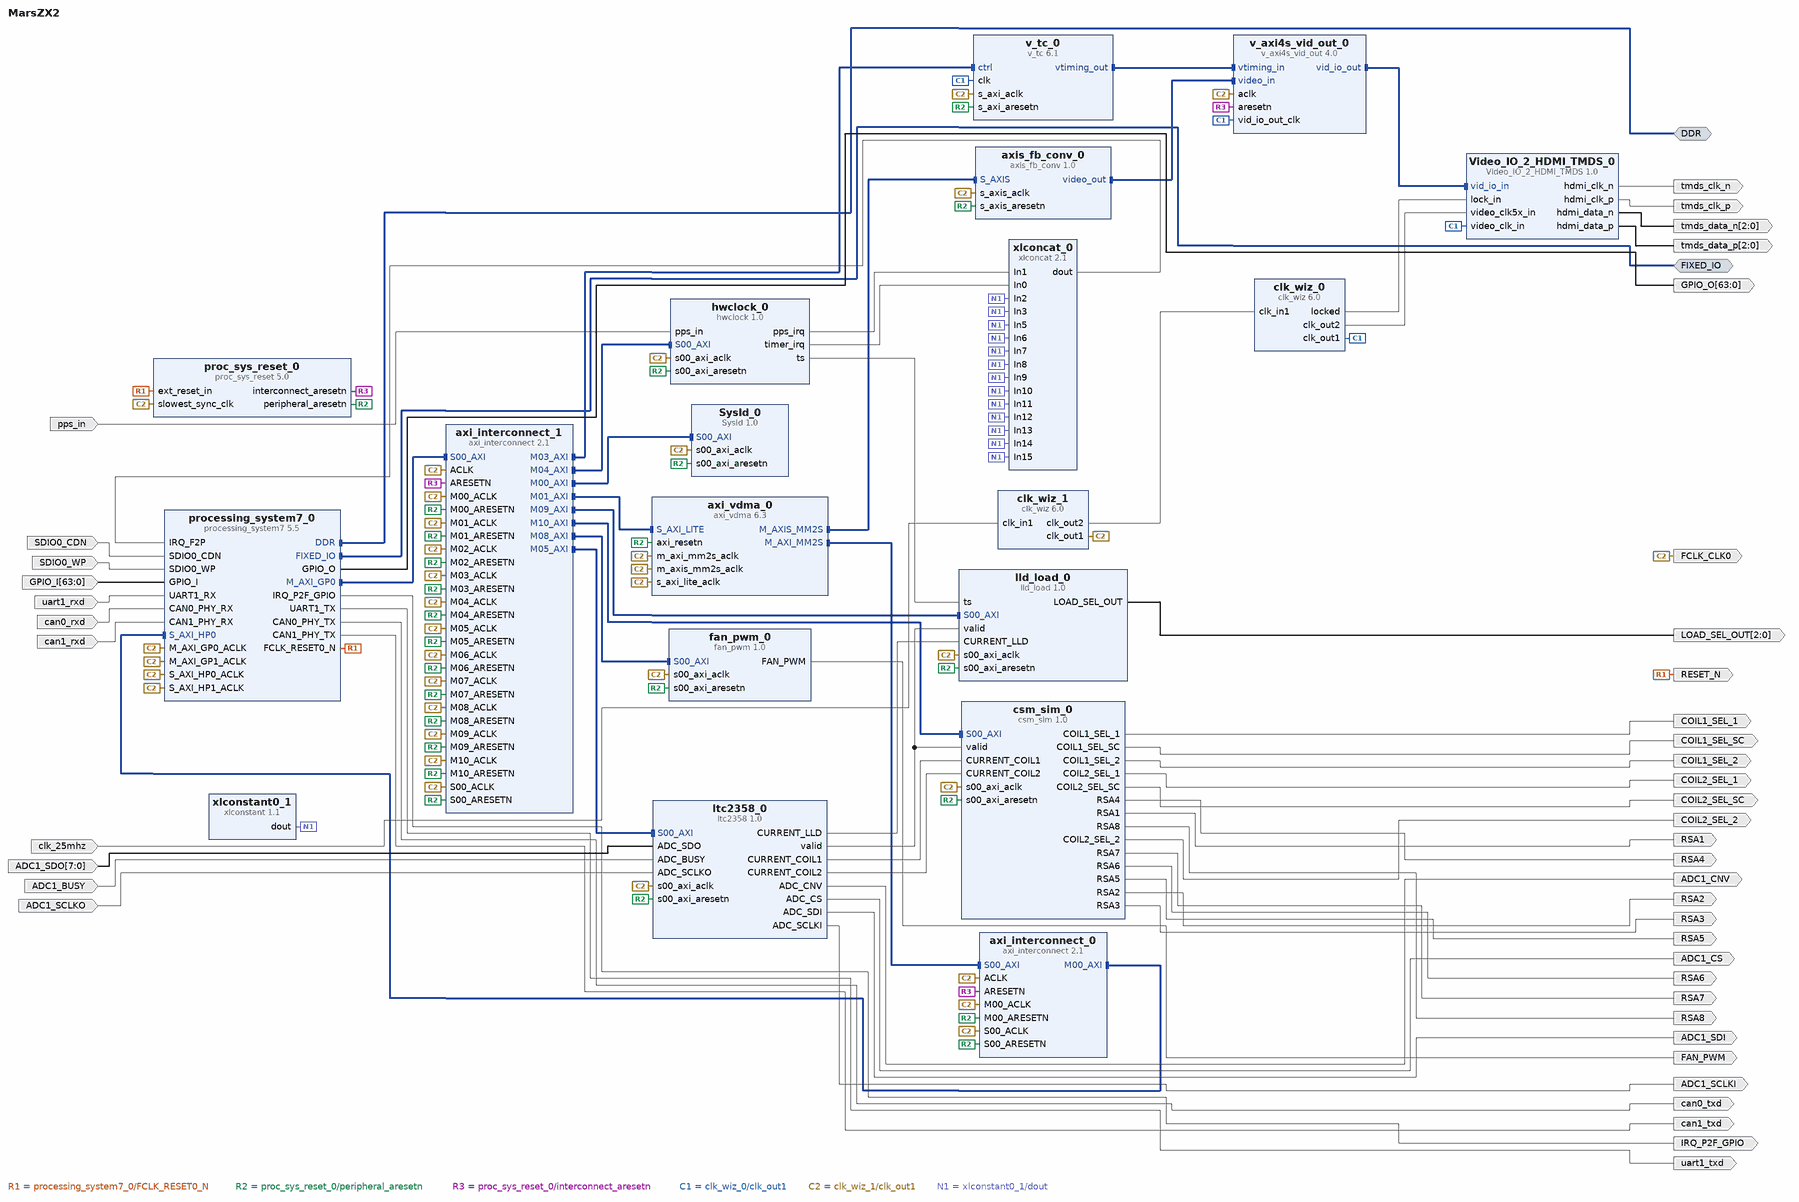
[diagram p0: block diagram of the top level]
# Vivado block design MarsZX2, xc7z010clg400-2, Vivado 2019.1
create_bd_design MarsZX2

create_bd_intf_port -mode Master -vlnv xilinx.com:interface:ddrx_rtl:1.0 DDR
create_bd_intf_port -mode Master -vlnv xilinx.com:display_processing_system7:fixedio_rtl:1.0 FIXED_IO
create_bd_port -dir I SDIO0_CDN
create_bd_port -dir I SDIO0_WP
create_bd_port -dir O -type clk FCLK_CLK0
create_bd_port -dir O -type rst RESET_N
create_bd_port -dir I -from 63 -to 0 GPIO_I
create_bd_port -dir O -from 63 -to 0 GPIO_O
create_bd_port -dir O IRQ_P2F_GPIO
create_bd_port -dir O -from 2 -to 0 tmds_data_p
create_bd_port -dir O -from 2 -to 0 tmds_data_n
create_bd_port -dir O -type clk tmds_clk_p
create_bd_port -dir O -type clk tmds_clk_n
create_bd_port -dir I -type clk clk_25mhz
set_property -dict {CONFIG.FREQ_HZ 25000000} [get_bd_ports clk_25mhz]
create_bd_port -dir I pps_in
create_bd_port -dir I uart1_rxd
create_bd_port -dir O uart1_txd
create_bd_port -dir I can0_rxd
create_bd_port -dir I can1_rxd
create_bd_port -dir O can0_txd
create_bd_port -dir O can1_txd
create_bd_port -dir O ADC1_SDI
create_bd_port -dir O ADC1_CNV
create_bd_port -dir O ADC1_CS
create_bd_port -dir O ADC1_SCLKI
create_bd_port -dir I ADC1_SCLKO
create_bd_port -dir I ADC1_BUSY
create_bd_port -dir I -from 7 -to 0 ADC1_SDO
create_bd_port -dir O RSA1
create_bd_port -dir O RSA2
create_bd_port -dir O RSA3
create_bd_port -dir O RSA4
create_bd_port -dir O RSA5
create_bd_port -dir O RSA6
create_bd_port -dir O RSA7
create_bd_port -dir O RSA8
create_bd_port -dir O -from 2 -to 0 LOAD_SEL_OUT
create_bd_port -dir O COIL1_SEL_SC
create_bd_port -dir O COIL1_SEL_1
create_bd_port -dir O COIL1_SEL_2
create_bd_port -dir O COIL2_SEL_SC
create_bd_port -dir O COIL2_SEL_1
create_bd_port -dir O COIL2_SEL_2
create_bd_port -dir O FAN_PWM

create_bd_cell -type ip -vlnv xilinx.com:user:SysId:1.0 SysId_0
set_property -dict {CONFIG.C_FPGA_ID 0x32320101} [get_bd_cells SysId_0]
create_bd_cell -type ip -vlnv trenz.biz:user:Video_IO_2_HDMI_TMDS:1.0 Video_IO_2_HDMI_TMDS_0
set_property -dict {CONFIG.C_INT_CLOCKING false} [get_bd_cells Video_IO_2_HDMI_TMDS_0]
create_bd_cell -type ip -vlnv xilinx.com:ip:axi_interconnect:2.1 axi_interconnect_0
set_property -dict {CONFIG.NUM_MI 1} [get_bd_cells axi_interconnect_0]
create_bd_cell -type ip -vlnv xilinx.com:ip:axi_interconnect:2.1 axi_interconnect_1
set_property -dict {CONFIG.NUM_MI 11 CONFIG.NUM_SI 1} [get_bd_cells axi_interconnect_1]
create_bd_cell -type ip -vlnv xilinx.com:ip:axi_vdma:6.3 axi_vdma_0
set_property -dict [list \
  CONFIG.c_include_s2mm 0 \
  CONFIG.c_mm2s_genlock_mode 0 \
  CONFIG.c_mm2s_max_burst_length 64 \
  CONFIG.c_num_fstores 1 \
] [get_bd_cells axi_vdma_0]
create_bd_cell -type ip -vlnv trenz.biz:user:axis_fb_conv:1.0 axis_fb_conv_0
create_bd_cell -type ip -vlnv xilinx.com:ip:clk_wiz:6.0 clk_wiz_0
set_property -dict [list \
  CONFIG.AXI_DRP false \
  CONFIG.CLKIN1_JITTER_PS 50.0 \
  CONFIG.CLKOUT1_JITTER 508.816 \
  CONFIG.CLKOUT1_PHASE_ERROR 431.542 \
  CONFIG.CLKOUT1_REQUESTED_OUT_FREQ 26.615 \
  CONFIG.CLKOUT2_JITTER 392.572 \
  CONFIG.CLKOUT2_PHASE_ERROR 431.542 \
  CONFIG.CLKOUT2_REQUESTED_OUT_FREQ 133.075 \
  CONFIG.CLKOUT2_USED true \
  CONFIG.CLKOUT3_JITTER 322.303 \
  CONFIG.CLKOUT3_PHASE_ERROR 494.032 \
  CONFIG.CLKOUT3_REQUESTED_OUT_FREQ 100.000 \
  CONFIG.CLKOUT3_USED false \
  CONFIG.MMCM_CLKFBOUT_MULT_F 43.250 \
  CONFIG.MMCM_CLKIN1_PERIOD 5.000 \
  CONFIG.MMCM_CLKIN2_PERIOD 10.0 \
  CONFIG.MMCM_CLKOUT0_DIVIDE_F 25.000 \
  CONFIG.MMCM_CLKOUT1_DIVIDE 5 \
  CONFIG.MMCM_CLKOUT2_DIVIDE 1 \
  CONFIG.MMCM_DIVCLK_DIVIDE 13 \
  CONFIG.NUM_OUT_CLKS 2 \
  CONFIG.PHASE_DUTY_CONFIG false \
  CONFIG.PRIM_IN_FREQ 200 \
  CONFIG.USE_DYN_RECONFIG false \
  CONFIG.USE_LOCKED true \
  CONFIG.USE_RESET false \
] [get_bd_cells clk_wiz_0]
create_bd_cell -type ip -vlnv xilinx.com:ip:clk_wiz:6.0 clk_wiz_1
set_property -dict [list \
  CONFIG.CLKIN1_JITTER_PS 400.0 \
  CONFIG.CLKOUT1_JITTER 226.965 \
  CONFIG.CLKOUT1_PHASE_ERROR 237.727 \
  CONFIG.CLKOUT2_JITTER 206.578 \
  CONFIG.CLKOUT2_PHASE_ERROR 237.727 \
  CONFIG.CLKOUT2_REQUESTED_OUT_FREQ 200 \
  CONFIG.CLKOUT2_USED true \
  CONFIG.MMCM_CLKFBOUT_MULT_F 40.000 \
  CONFIG.MMCM_CLKIN1_PERIOD 40.000 \
  CONFIG.MMCM_CLKIN2_PERIOD 10.0 \
  CONFIG.MMCM_CLKOUT1_DIVIDE 5 \
  CONFIG.NUM_OUT_CLKS 2 \
  CONFIG.PRIM_IN_FREQ 25 \
  CONFIG.USE_LOCKED false \
  CONFIG.USE_RESET false \
] [get_bd_cells clk_wiz_1]
create_bd_cell -type ip -vlnv xilinx.com:ip:proc_sys_reset:5.0 proc_sys_reset_0
create_bd_cell -type ip -vlnv xilinx.com:ip:processing_system7:5.5 processing_system7_0
set_property -dict [list \
  CONFIG.PCW_APU_PERIPHERAL_FREQMHZ 750 \
  CONFIG.PCW_CAN0_CAN0_IO EMIO \
  CONFIG.PCW_CAN0_PERIPHERAL_ENABLE 1 \
  CONFIG.PCW_CAN1_CAN1_IO EMIO \
  CONFIG.PCW_CAN1_PERIPHERAL_ENABLE 1 \
  CONFIG.PCW_CPU_CPU_6X4X_MAX_RANGE 767 \
  CONFIG.PCW_CRYSTAL_PERIPHERAL_FREQMHZ 33.333333333333 \
  CONFIG.PCW_ENET0_ENET0_IO {MIO 16 .. 27} \
  CONFIG.PCW_ENET0_GRP_MDIO_ENABLE 1 \
  CONFIG.PCW_ENET0_GRP_MDIO_IO {MIO 52 .. 53} \
  CONFIG.PCW_ENET0_PERIPHERAL_ENABLE 1 \
  CONFIG.PCW_ENET_RESET_ENABLE 0 \
  CONFIG.PCW_FCLK0_PERIPHERAL_CLKSRC {ARM PLL} \
  CONFIG.PCW_FCLK_CLK0_BUF FALSE \
  CONFIG.PCW_FPGA0_PERIPHERAL_FREQMHZ 100 \
  CONFIG.PCW_FPGA1_PERIPHERAL_FREQMHZ 50 \
  CONFIG.PCW_GP0_EN_MODIFIABLE_TXN 0 \
  CONFIG.PCW_GP1_EN_MODIFIABLE_TXN 0 \
  CONFIG.PCW_GPIO_EMIO_GPIO_ENABLE 1 \
  CONFIG.PCW_GPIO_EMIO_GPIO_IO 64 \
  CONFIG.PCW_GPIO_MIO_GPIO_ENABLE 1 \
  CONFIG.PCW_GPIO_MIO_GPIO_IO MIO \
  CONFIG.PCW_I2C0_GRP_INT_ENABLE 1 \
  CONFIG.PCW_I2C0_GRP_INT_IO EMIO \
  CONFIG.PCW_I2C0_I2C0_IO {MIO 14 .. 15} \
  CONFIG.PCW_I2C0_PERIPHERAL_ENABLE 1 \
  CONFIG.PCW_I2C_PERIPHERAL_FREQMHZ 125.000000 \
  CONFIG.PCW_I2C_RESET_ENABLE 0 \
  CONFIG.PCW_IRQ_F2P_INTR 1 \
  CONFIG.PCW_OVERRIDE_BASIC_CLOCK 1 \
  CONFIG.PCW_P2F_GPIO_INTR 1 \
  CONFIG.PCW_PERIPHERAL_BOARD_PRESET None \
  CONFIG.PCW_PRESET_BANK1_VOLTAGE {LVCMOS 3.3V} \
  CONFIG.PCW_QSPI_GRP_FBCLK_ENABLE 1 \
  CONFIG.PCW_QSPI_GRP_FBCLK_IO {MIO 8} \
  CONFIG.PCW_QSPI_GRP_SINGLE_SS_ENABLE 1 \
  CONFIG.PCW_QSPI_GRP_SINGLE_SS_IO {MIO 1 .. 6} \
  CONFIG.PCW_QSPI_PERIPHERAL_ENABLE 1 \
  CONFIG.PCW_QSPI_QSPI_IO {MIO 1 .. 6} \
  CONFIG.PCW_SD0_GRP_CD_ENABLE 1 \
  CONFIG.PCW_SD0_GRP_CD_IO EMIO \
  CONFIG.PCW_SD0_GRP_WP_ENABLE 1 \
  CONFIG.PCW_SD0_GRP_WP_IO EMIO \
  CONFIG.PCW_SD0_PERIPHERAL_ENABLE 1 \
  CONFIG.PCW_SD0_SD0_IO {MIO 40 .. 45} \
  CONFIG.PCW_SDIO_PERIPHERAL_FREQMHZ 100 \
  CONFIG.PCW_SINGLE_QSPI_DATA_MODE x4 \
  CONFIG.PCW_S_AXI_HP1_DATA_WIDTH 32 \
  CONFIG.PCW_TTC1_PERIPHERAL_ENABLE 1 \
  CONFIG.PCW_TTC1_TTC1_IO EMIO \
  CONFIG.PCW_UART0_PERIPHERAL_ENABLE 1 \
  CONFIG.PCW_UART0_UART0_IO {MIO 46 .. 47} \
  CONFIG.PCW_UART1_PERIPHERAL_ENABLE 1 \
  CONFIG.PCW_UART1_UART1_IO EMIO \
  CONFIG.PCW_UART_PERIPHERAL_FREQMHZ 100 \
  CONFIG.PCW_UIPARAM_DDR_BUS_WIDTH {16 Bit} \
  CONFIG.PCW_UIPARAM_DDR_FREQ_MHZ 533.3333 \
  CONFIG.PCW_UIPARAM_DDR_MEMORY_TYPE {DDR 3 (Low Voltage)} \
  CONFIG.PCW_UIPARAM_DDR_PARTNO {MT41K256M16 RE-125} \
  CONFIG.PCW_USB0_PERIPHERAL_ENABLE 1 \
  CONFIG.PCW_USB0_USB0_IO {MIO 28 .. 39} \
  CONFIG.PCW_USB_RESET_ENABLE 0 \
  CONFIG.PCW_USE_FABRIC_INTERRUPT 1 \
  CONFIG.PCW_USE_M_AXI_GP1 1 \
  CONFIG.PCW_USE_S_AXI_HP0 1 \
  CONFIG.PCW_USE_S_AXI_HP1 1 \
  CONFIG.PCW_WDT_PERIPHERAL_ENABLE 1 \
  CONFIG.PCW_WDT_WDT_IO EMIO \
] [get_bd_cells processing_system7_0]
# 546 more settings of processing_system7_0 are not shown: defaults, MIO pin electricals, DDR timing, and values the tool derives
create_bd_cell -type ip -vlnv xilinx.com:ip:v_axi4s_vid_out:4.0 v_axi4s_vid_out_0
set_property -dict {CONFIG.C_HAS_ASYNC_CLK 1 CONFIG.C_VTG_MASTER_SLAVE 1} [get_bd_cells v_axi4s_vid_out_0]
create_bd_cell -type ip -vlnv xilinx.com:ip:v_tc:6.1 v_tc_0
set_property -dict [list \
  CONFIG.GEN_F0_VBLANK_HEND 800 \
  CONFIG.GEN_F0_VBLANK_HSTART 800 \
  CONFIG.GEN_F0_VFRAME_SIZE 504 \
  CONFIG.GEN_F0_VSYNC_HEND 800 \
  CONFIG.GEN_F0_VSYNC_HSTART 800 \
  CONFIG.GEN_F0_VSYNC_VEND 484 \
  CONFIG.GEN_F0_VSYNC_VSTART 480 \
  CONFIG.GEN_HACTIVE_SIZE 800 \
  CONFIG.GEN_HFRAME_SIZE 1056 \
  CONFIG.GEN_HSYNC_END 968 \
  CONFIG.GEN_HSYNC_START 840 \
  CONFIG.GEN_VACTIVE_SIZE 480 \
  CONFIG.VIDEO_MODE Custom \
  CONFIG.enable_detection false \
] [get_bd_cells v_tc_0]
create_bd_cell -type ip -vlnv xilinx.com:ip:xlconcat:2.1 xlconcat_0
set_property -dict {CONFIG.NUM_PORTS 16 CONFIG.dout_width 16} [get_bd_cells xlconcat_0]
create_bd_cell -type ip -vlnv xilinx.com:ip:xlconstant:1.1 xlconstant0_1
set_property -dict {CONFIG.CONST_VAL 0} [get_bd_cells xlconstant0_1]
create_bd_cell -type ip -vlnv user.org:user:hwclock:1.0 hwclock_0
create_bd_cell -type ip -vlnv user.org:user:ltc2358:1.0 ltc2358_0
create_bd_cell -type ip -vlnv user.org:user:lld_load:1.0 lld_load_0
create_bd_cell -type ip -vlnv user.org:user:csm_sim:1.0 csm_sim_0
create_bd_cell -type ip -vlnv user.org:user:fan_pwm:1.0 fan_pwm_0

# ---- connections ----

connect_bd_intf_net [get_bd_intf_pins processing_system7_0/S_AXI_HP0] [get_bd_intf_pins axi_interconnect_0/M00_AXI]
connect_bd_intf_net [get_bd_intf_pins axi_interconnect_1/M05_AXI] [get_bd_intf_pins ltc2358_0/S00_AXI]
connect_bd_intf_net [get_bd_intf_pins axi_vdma_0/S_AXI_LITE] [get_bd_intf_pins axi_interconnect_1/M01_AXI]
connect_bd_intf_net [get_bd_intf_pins v_axi4s_vid_out_0/video_in] [get_bd_intf_pins axis_fb_conv_0/video_out]
connect_bd_intf_net [get_bd_intf_pins Video_IO_2_HDMI_TMDS_0/vid_io_in] [get_bd_intf_pins v_axi4s_vid_out_0/vid_io_out]
connect_bd_intf_net [get_bd_intf_ports DDR] [get_bd_intf_pins processing_system7_0/DDR]
connect_bd_intf_net [get_bd_intf_pins SysId_0/S00_AXI] [get_bd_intf_pins axi_interconnect_1/M00_AXI]
connect_bd_intf_net [get_bd_intf_pins v_tc_0/ctrl] [get_bd_intf_pins axi_interconnect_1/M03_AXI]
connect_bd_intf_net [get_bd_intf_pins v_axi4s_vid_out_0/vtiming_in] [get_bd_intf_pins v_tc_0/vtiming_out]
connect_bd_intf_net [get_bd_intf_pins axi_interconnect_1/M04_AXI] [get_bd_intf_pins hwclock_0/S00_AXI]
connect_bd_intf_net [get_bd_intf_pins processing_system7_0/M_AXI_GP0] [get_bd_intf_pins axi_interconnect_1/S00_AXI]
connect_bd_intf_net [get_bd_intf_ports FIXED_IO] [get_bd_intf_pins processing_system7_0/FIXED_IO]
connect_bd_intf_net [get_bd_intf_pins axi_interconnect_0/S00_AXI] [get_bd_intf_pins axi_vdma_0/M_AXI_MM2S]
connect_bd_intf_net [get_bd_intf_pins csm_sim_0/S00_AXI] [get_bd_intf_pins axi_interconnect_1/M10_AXI]
connect_bd_intf_net [get_bd_intf_pins axis_fb_conv_0/S_AXIS] [get_bd_intf_pins axi_vdma_0/M_AXIS_MM2S]
connect_bd_intf_net [get_bd_intf_pins lld_load_0/S00_AXI] [get_bd_intf_pins axi_interconnect_1/M09_AXI]
connect_bd_intf_net [get_bd_intf_pins fan_pwm_0/S00_AXI] [get_bd_intf_pins axi_interconnect_1/M08_AXI]
connect_bd_net [get_bd_pins processing_system7_0/FCLK_RESET0_N] [get_bd_ports RESET_N] [get_bd_pins proc_sys_reset_0/ext_reset_in]
connect_bd_net [get_bd_pins proc_sys_reset_0/peripheral_aresetn] \
  [get_bd_pins SysId_0/s00_axi_aresetn] [get_bd_pins axi_interconnect_0/S00_ARESETN] \
  [get_bd_pins axi_interconnect_0/M00_ARESETN] [get_bd_pins axi_interconnect_1/S00_ARESETN] \
  [get_bd_pins axi_interconnect_1/M00_ARESETN] [get_bd_pins axi_interconnect_1/M01_ARESETN] \
  [get_bd_pins axi_interconnect_1/M02_ARESETN] [get_bd_pins axi_interconnect_1/M03_ARESETN] \
  [get_bd_pins axi_interconnect_1/M04_ARESETN] [get_bd_pins axi_interconnect_1/M05_ARESETN] \
  [get_bd_pins axi_interconnect_1/M06_ARESETN] [get_bd_pins axi_interconnect_1/M07_ARESETN] \
  [get_bd_pins axi_interconnect_1/M08_ARESETN] [get_bd_pins axi_interconnect_1/M09_ARESETN] \
  [get_bd_pins axi_interconnect_1/M10_ARESETN] [get_bd_pins axi_vdma_0/axi_resetn] \
  [get_bd_pins axis_fb_conv_0/s_axis_aresetn] [get_bd_pins v_tc_0/s_axi_aresetn] [get_bd_pins hwclock_0/s00_axi_aresetn] \
  [get_bd_pins ltc2358_0/s00_axi_aresetn] [get_bd_pins lld_load_0/s00_axi_aresetn] [get_bd_pins csm_sim_0/s00_axi_aresetn] \
  [get_bd_pins fan_pwm_0/s00_axi_aresetn]
connect_bd_net [get_bd_pins proc_sys_reset_0/interconnect_aresetn] \
  [get_bd_pins axi_interconnect_0/ARESETN] [get_bd_pins axi_interconnect_1/ARESETN] [get_bd_pins v_axi4s_vid_out_0/aresetn]
connect_bd_net [get_bd_ports SDIO0_CDN] [get_bd_pins processing_system7_0/SDIO0_CDN]
connect_bd_net [get_bd_pins processing_system7_0/GPIO_O] [get_bd_ports GPIO_O]
connect_bd_net [get_bd_pins xlconcat_0/dout] [get_bd_pins processing_system7_0/IRQ_F2P]
connect_bd_net [get_bd_pins processing_system7_0/IRQ_P2F_GPIO] [get_bd_ports IRQ_P2F_GPIO]
connect_bd_net [get_bd_ports SDIO0_WP] [get_bd_pins processing_system7_0/SDIO0_WP]
connect_bd_net [get_bd_ports GPIO_I] [get_bd_pins processing_system7_0/GPIO_I]
connect_bd_net [get_bd_pins clk_wiz_0/clk_out1] \
  [get_bd_pins Video_IO_2_HDMI_TMDS_0/video_clk_in] [get_bd_pins v_axi4s_vid_out_0/vid_io_out_clk] [get_bd_pins v_tc_0/clk]
connect_bd_net [get_bd_pins Video_IO_2_HDMI_TMDS_0/hdmi_data_p] [get_bd_ports tmds_data_p]
connect_bd_net [get_bd_pins Video_IO_2_HDMI_TMDS_0/hdmi_data_n] [get_bd_ports tmds_data_n]
connect_bd_net [get_bd_pins Video_IO_2_HDMI_TMDS_0/hdmi_clk_p] [get_bd_ports tmds_clk_p]
connect_bd_net [get_bd_pins Video_IO_2_HDMI_TMDS_0/hdmi_clk_n] [get_bd_ports tmds_clk_n]
connect_bd_net [get_bd_pins clk_wiz_0/locked] [get_bd_pins Video_IO_2_HDMI_TMDS_0/lock_in]
connect_bd_net [get_bd_ports clk_25mhz] [get_bd_pins clk_wiz_1/clk_in1]
connect_bd_net [get_bd_pins hwclock_0/pps_irq] [get_bd_pins xlconcat_0/In1]
connect_bd_net [get_bd_ports pps_in] [get_bd_pins hwclock_0/pps_in]
connect_bd_net [get_bd_pins hwclock_0/timer_irq] [get_bd_pins xlconcat_0/In0]
connect_bd_net -net processing_system7_0_FCLK_CLK0 [get_bd_pins clk_wiz_1/clk_out1] \
  [get_bd_ports FCLK_CLK0] [get_bd_pins SysId_0/s00_axi_aclk] [get_bd_pins axi_interconnect_0/ACLK] \
  [get_bd_pins axi_interconnect_0/S00_ACLK] [get_bd_pins axi_interconnect_0/M00_ACLK] [get_bd_pins axi_interconnect_1/ACLK] \
  [get_bd_pins axi_interconnect_1/S00_ACLK] [get_bd_pins axi_interconnect_1/M00_ACLK] \
  [get_bd_pins axi_interconnect_1/M01_ACLK] [get_bd_pins axi_interconnect_1/M02_ACLK] \
  [get_bd_pins axi_interconnect_1/M03_ACLK] [get_bd_pins axi_interconnect_1/M04_ACLK] \
  [get_bd_pins axi_interconnect_1/M05_ACLK] [get_bd_pins axi_interconnect_1/M06_ACLK] \
  [get_bd_pins axi_interconnect_1/M07_ACLK] [get_bd_pins axi_interconnect_1/M08_ACLK] \
  [get_bd_pins axi_interconnect_1/M09_ACLK] [get_bd_pins axi_interconnect_1/M10_ACLK] \
  [get_bd_pins axi_vdma_0/s_axi_lite_aclk] [get_bd_pins axi_vdma_0/m_axi_mm2s_aclk] [get_bd_pins axi_vdma_0/m_axis_mm2s_aclk] \
  [get_bd_pins axis_fb_conv_0/s_axis_aclk] [get_bd_pins proc_sys_reset_0/slowest_sync_clk] \
  [get_bd_pins processing_system7_0/M_AXI_GP0_ACLK] [get_bd_pins processing_system7_0/M_AXI_GP1_ACLK] \
  [get_bd_pins processing_system7_0/S_AXI_HP0_ACLK] [get_bd_pins processing_system7_0/S_AXI_HP1_ACLK] \
  [get_bd_pins v_axi4s_vid_out_0/aclk] [get_bd_pins v_tc_0/s_axi_aclk] [get_bd_pins hwclock_0/s00_axi_aclk] \
  [get_bd_pins ltc2358_0/s00_axi_aclk] [get_bd_pins lld_load_0/s00_axi_aclk] [get_bd_pins csm_sim_0/s00_axi_aclk] \
  [get_bd_pins fan_pwm_0/s00_axi_aclk]
connect_bd_net [get_bd_pins clk_wiz_0/clk_out2] [get_bd_pins Video_IO_2_HDMI_TMDS_0/video_clk5x_in]
connect_bd_net [get_bd_ports uart1_rxd] [get_bd_pins processing_system7_0/UART1_RX]
connect_bd_net [get_bd_pins processing_system7_0/UART1_TX] [get_bd_ports uart1_txd]
connect_bd_net [get_bd_pins hwclock_0/ts] [get_bd_pins lld_load_0/ts]
connect_bd_net [get_bd_pins processing_system7_0/CAN0_PHY_TX] [get_bd_ports can0_txd]
connect_bd_net [get_bd_pins processing_system7_0/CAN1_PHY_TX] [get_bd_ports can1_txd]
connect_bd_net [get_bd_ports can0_rxd] [get_bd_pins processing_system7_0/CAN0_PHY_RX]
connect_bd_net [get_bd_ports can1_rxd] [get_bd_pins processing_system7_0/CAN1_PHY_RX]
connect_bd_net -net xlconstant_1_dout [get_bd_pins xlconstant0_1/dout] \
  [get_bd_pins xlconcat_0/In2] [get_bd_pins xlconcat_0/In3] [get_bd_pins xlconcat_0/In5] [get_bd_pins xlconcat_0/In6] \
  [get_bd_pins xlconcat_0/In7] [get_bd_pins xlconcat_0/In8] [get_bd_pins xlconcat_0/In9] [get_bd_pins xlconcat_0/In10] \
  [get_bd_pins xlconcat_0/In11] [get_bd_pins xlconcat_0/In12] [get_bd_pins xlconcat_0/In13] [get_bd_pins xlconcat_0/In14] \
  [get_bd_pins xlconcat_0/In15]
connect_bd_net [get_bd_pins ltc2358_0/ADC_SDI] [get_bd_ports ADC1_SDI]
connect_bd_net [get_bd_pins ltc2358_0/ADC_CNV] [get_bd_ports ADC1_CNV]
connect_bd_net [get_bd_pins ltc2358_0/ADC_CS] [get_bd_ports ADC1_CS]
connect_bd_net [get_bd_pins ltc2358_0/ADC_SCLKI] [get_bd_ports ADC1_SCLKI]
connect_bd_net [get_bd_ports ADC1_SDO] [get_bd_pins ltc2358_0/ADC_SDO]
connect_bd_net [get_bd_ports ADC1_BUSY] [get_bd_pins ltc2358_0/ADC_BUSY]
connect_bd_net [get_bd_ports ADC1_SCLKO] [get_bd_pins ltc2358_0/ADC_SCLKO]
connect_bd_net [get_bd_pins clk_wiz_1/clk_out2] [get_bd_pins clk_wiz_0/clk_in1]
connect_bd_net [get_bd_pins ltc2358_0/valid] [get_bd_pins lld_load_0/valid] [get_bd_pins csm_sim_0/valid]
connect_bd_net [get_bd_pins ltc2358_0/CURRENT_COIL1] [get_bd_pins csm_sim_0/CURRENT_COIL1]
connect_bd_net [get_bd_pins ltc2358_0/CURRENT_COIL2] [get_bd_pins csm_sim_0/CURRENT_COIL2]
connect_bd_net [get_bd_pins csm_sim_0/RSA8] [get_bd_ports RSA8]
connect_bd_net [get_bd_pins csm_sim_0/RSA7] [get_bd_ports RSA7]
connect_bd_net [get_bd_pins csm_sim_0/RSA6] [get_bd_ports RSA6]
connect_bd_net [get_bd_pins csm_sim_0/RSA5] [get_bd_ports RSA5]
connect_bd_net [get_bd_pins csm_sim_0/RSA4] [get_bd_ports RSA4]
connect_bd_net [get_bd_pins csm_sim_0/RSA3] [get_bd_ports RSA3]
connect_bd_net [get_bd_pins csm_sim_0/RSA2] [get_bd_ports RSA2]
connect_bd_net [get_bd_pins csm_sim_0/RSA1] [get_bd_ports RSA1]
connect_bd_net [get_bd_pins ltc2358_0/CURRENT_LLD] [get_bd_pins lld_load_0/CURRENT_LLD]
connect_bd_net [get_bd_pins lld_load_0/LOAD_SEL_OUT] [get_bd_ports LOAD_SEL_OUT]
connect_bd_net [get_bd_pins csm_sim_0/COIL1_SEL_SC] [get_bd_ports COIL1_SEL_SC]
connect_bd_net [get_bd_pins csm_sim_0/COIL1_SEL_1] [get_bd_ports COIL1_SEL_1]
connect_bd_net [get_bd_pins csm_sim_0/COIL1_SEL_2] [get_bd_ports COIL1_SEL_2]
connect_bd_net [get_bd_pins csm_sim_0/COIL2_SEL_SC] [get_bd_ports COIL2_SEL_SC]
connect_bd_net [get_bd_pins csm_sim_0/COIL2_SEL_1] [get_bd_ports COIL2_SEL_1]
connect_bd_net [get_bd_pins csm_sim_0/COIL2_SEL_2] [get_bd_ports COIL2_SEL_2]
connect_bd_net [get_bd_pins fan_pwm_0/FAN_PWM] [get_bd_ports FAN_PWM]

# ---- address map ----
assign_bd_address -offset 0x00000000 -range 512M -target_address_space [get_bd_addr_spaces axi_vdma_0/Data_MM2S] [get_bd_addr_segs processing_system7_0/S_AXI_HP0/HP0_DDR_LOWOCM]
assign_bd_address -offset 0x43C00000 -range 64K -target_address_space [get_bd_addr_spaces processing_system7_0/Data] [get_bd_addr_segs hwclock_0/S00_AXI/S00_AXI_reg]
assign_bd_address -offset 0x43C10000 -range 64K -target_address_space [get_bd_addr_spaces processing_system7_0/Data] [get_bd_addr_segs axi_vdma_0/S_AXI_LITE/Reg]
assign_bd_address -offset 0x43C20000 -range 64K -target_address_space [get_bd_addr_spaces processing_system7_0/Data] [get_bd_addr_segs v_tc_0/ctrl/Reg]
assign_bd_address -offset 0x43C30000 -range 64K -target_address_space [get_bd_addr_spaces processing_system7_0/Data] [get_bd_addr_segs ltc2358_0/S00_AXI/S00_AXI_reg]
assign_bd_address -offset 0x43C40000 -range 64K -target_address_space [get_bd_addr_spaces processing_system7_0/Data] [get_bd_addr_segs csm_sim_0/S00_AXI/S00_AXI_reg]
assign_bd_address -offset 0x43C50000 -range 64K -target_address_space [get_bd_addr_spaces processing_system7_0/Data] [get_bd_addr_segs fan_pwm_0/S00_AXI/S00_AXI_reg]
assign_bd_address -offset 0x43C70000 -range 64K -target_address_space [get_bd_addr_spaces processing_system7_0/Data] [get_bd_addr_segs lld_load_0/S00_AXI/S00_AXI_reg]
assign_bd_address -offset 0x43FF0000 -range 64K -target_address_space [get_bd_addr_spaces processing_system7_0/Data] [get_bd_addr_segs SysId_0/S00_AXI/S00_AXI_reg]

validate_bd_design
save_bd_design
